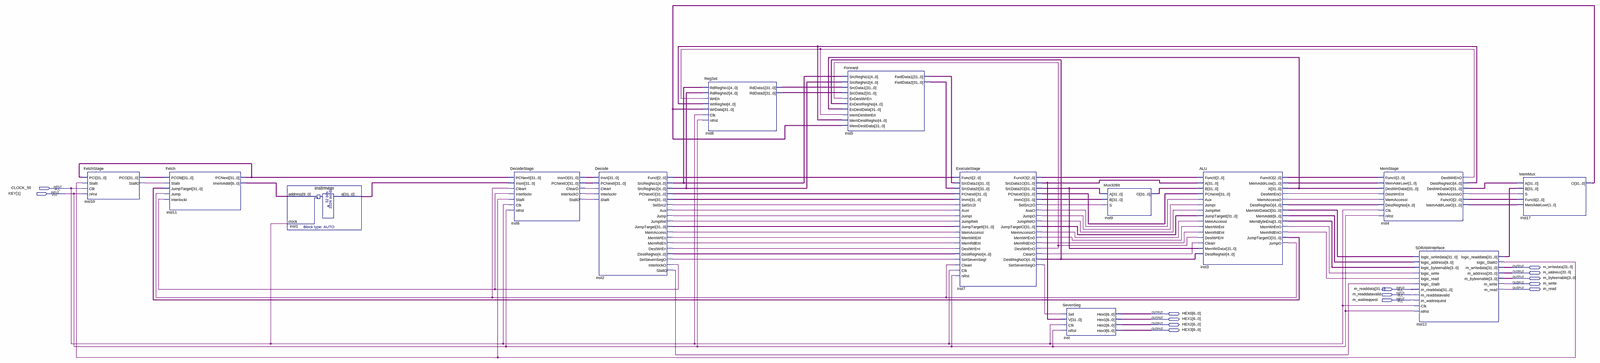
[diagram p0: schematic sheet, whole]
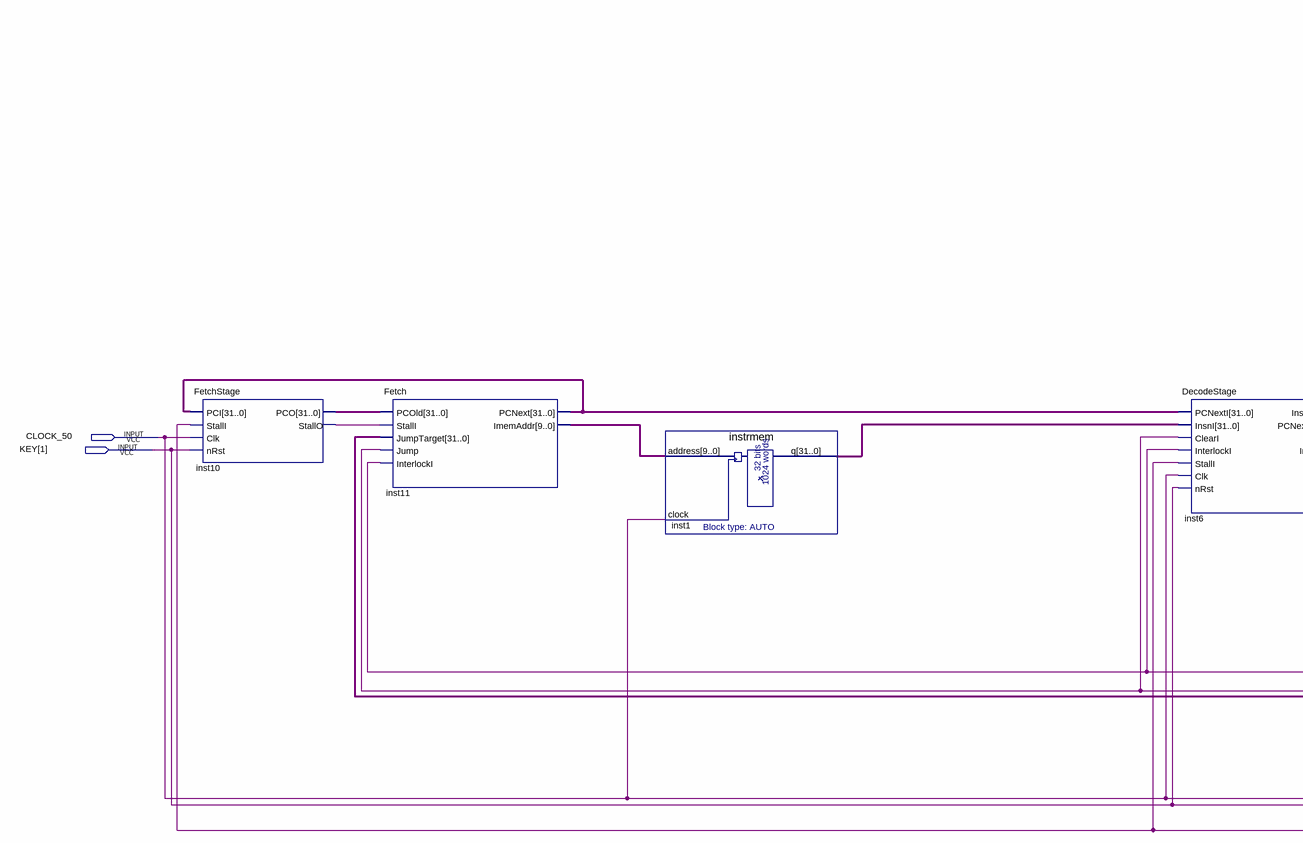
[diagram p1: schematic sheet, left part]
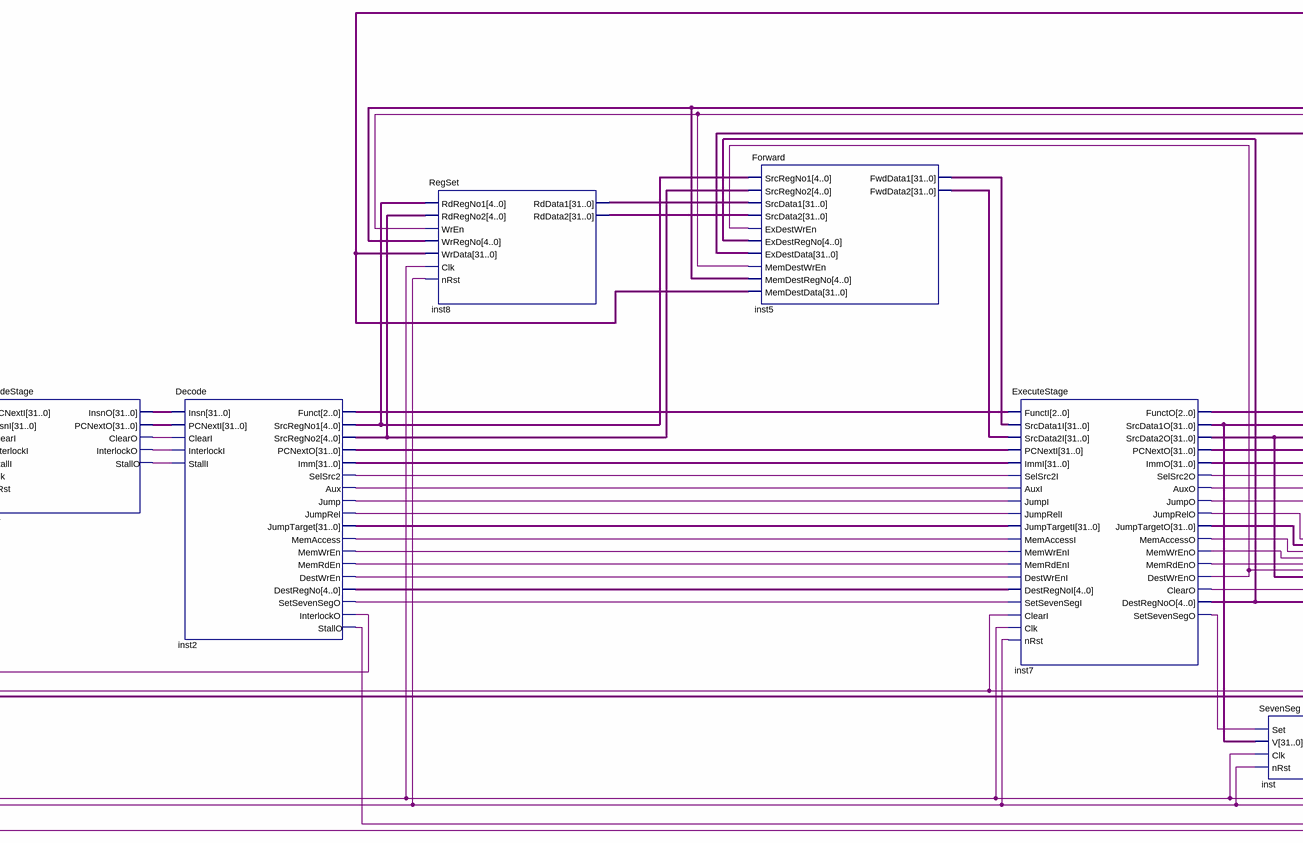
[diagram p2: schematic sheet, centre part]
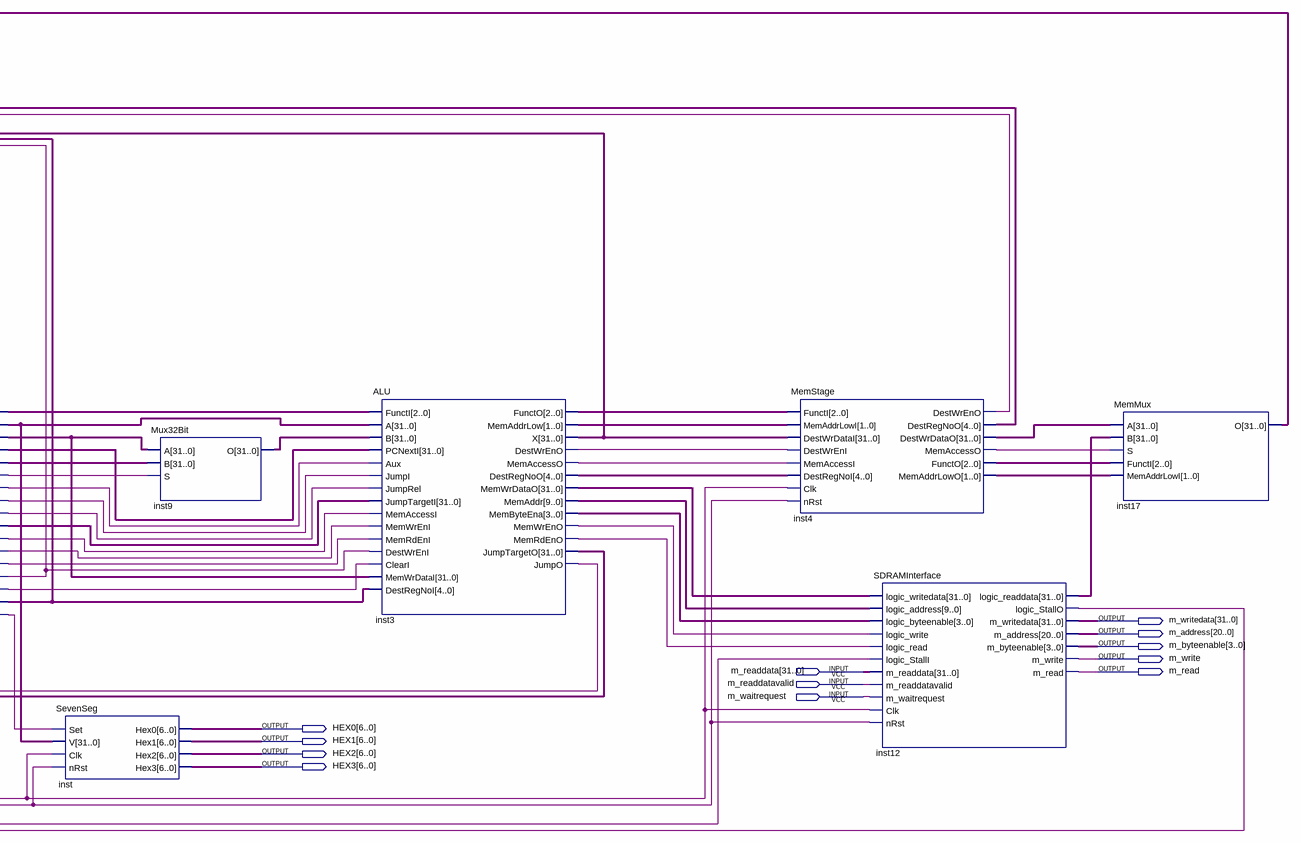
[diagram p3: schematic sheet, right part]
// Quartus schematic RISCV_SDRAM.bdf as structural Verilog: 14 symbols, 14 pins
module RISCV_SDRAM (
  input  CLOCK_50,
  input  [1:1] KEY,
  input  [31:0] m_readdata,
  input  m_readdatavalid,
  input  m_waitrequest,
  output [31:0] m_writedata,
  output [20:0] m_address,
  output [3:0] m_byteenable,
  output m_write,
  output m_read,
  output [6:0] HEX0,
  output [6:0] HEX1,
  output [6:0] HEX2,
  output [6:0] HEX3
);

  wire inst2_aux, inst2_destwren, inst2_interlocko, inst2_jump, inst2_jumprel, inst2_memaccess,
       inst2_memrden, inst2_memwren, inst2_selsrc2, inst2_setsevensego, inst2_stallo, inst3_destwreno,
       inst3_jumpo, inst3_memaccesso, inst3_memrdeno, inst3_memwreno, inst4_destwreno, inst4_memaccesso,
       inst6_clearo, inst6_interlocko, inst6_stallo, inst7_auxo, inst7_clearo, inst7_destwreno, inst7_jumpo,
       inst7_jumprelo, inst7_memaccesso, inst7_memrdeno, inst7_memwreno, inst7_selsrc2o, inst7_setsevensego,
       inst10_stallo, inst12_logic_stallo;
  wire [1:0] inst3_memaddrlow, inst4_memaddrlowo;
  wire [2:0] inst2_funct, inst3_functo, inst4_functo, inst7_functo;
  wire [3:0] inst3_membyteena;
  wire [4:0] inst2_destregno, inst2_srcregno1, inst2_srcregno2, inst3_destregnoo, inst4_destregnoo,
       inst7_destregnoo;
  wire [9:0] inst3_memaddr, inst11_imemaddr;
  wire [31:0] inst1_q, inst2_imm, inst2_jumptarget, inst2_pcnexto, inst3_jumptargeto, inst3_memwrdatao,
       inst3_x, inst4_destwrdatao, inst5_fwddata1, inst5_fwddata2, inst6_insno, inst6_pcnexto, inst7_immo,
       inst7_jumptargeto, inst7_pcnexto, inst7_srcdata1o, inst7_srcdata2o, inst8_rddata1, inst8_rddata2,
       inst9_o, inst10_pco, inst11_pcnext, inst12_logic_readdata, inst17_o;

  FetchStage inst10 (
    .PCI(inst11_pcnext), .StallI(inst12_logic_stallo), .Clk(CLOCK_50), .nRst(KEY[1]), .PCO(inst10_pco),
    .StallO(inst10_stallo));
  Fetch inst11 (
    .PCOld(inst10_pco), .StallI(inst10_stallo), .JumpTarget(inst3_jumptargeto), .Jump(inst3_jumpo),
    .InterlockI(inst2_interlocko), .PCNext(inst11_pcnext), .ImemAddr(inst11_imemaddr));
  instrmem inst1 (.address(inst11_imemaddr), .clock(CLOCK_50), .q(inst1_q));
  DecodeStage inst6 (
    .PCNextI(inst11_pcnext), .InsnI(inst1_q), .ClearI(inst3_jumpo), .InterlockI(inst2_interlocko),
    .StallI(inst12_logic_stallo), .Clk(CLOCK_50), .nRst(KEY[1]), .InsnO(inst6_insno),
    .PCNextO(inst6_pcnexto), .ClearO(inst6_clearo), .InterlockO(inst6_interlocko), .StallO(inst6_stallo));
  Decode inst2 (
    .Insn(inst6_insno), .PCNextI(inst6_pcnexto), .ClearI(inst6_clearo), .InterlockI(inst6_interlocko),
    .StallI(inst6_stallo), .Funct(inst2_funct), .SrcRegNo1(inst2_srcregno1), .SrcRegNo2(inst2_srcregno2),
    .PCNextO(inst2_pcnexto), .Imm(inst2_imm), .SelSrc2(inst2_selsrc2), .Aux(inst2_aux), .Jump(inst2_jump),
    .JumpRel(inst2_jumprel), .JumpTarget(inst2_jumptarget), .MemAccess(inst2_memaccess),
    .MemWrEn(inst2_memwren), .MemRdEn(inst2_memrden), .DestWrEn(inst2_destwren), .DestRegNo(inst2_destregno),
    .SetSevenSegO(inst2_setsevensego), .InterlockO(inst2_interlocko), .StallO(inst2_stallo));
  RegSet inst8 (
    .RdRegNo1(inst2_srcregno1), .RdRegNo2(inst2_srcregno2), .WrEn(inst4_destwreno),
    .WrRegNo(inst4_destregnoo), .WrData(inst17_o), .Clk(CLOCK_50), .nRst(KEY[1]), .RdData1(inst8_rddata1),
    .RdData2(inst8_rddata2));
  Forward inst5 (
    .SrcRegNo1(inst2_srcregno1), .SrcRegNo2(inst2_srcregno2), .SrcData1(inst8_rddata1),
    .SrcData2(inst8_rddata2), .ExDestWrEn(inst7_destwreno), .ExDestRegNo(inst7_destregnoo),
    .ExDestData(inst3_x), .MemDestWrEn(inst4_destwreno), .MemDestRegNo(inst4_destregnoo),
    .MemDestData(inst17_o), .FwdData1(inst5_fwddata1), .FwdData2(inst5_fwddata2));
  ExecuteStage inst7 (
    .FunctI(inst2_funct), .SrcData1I(inst5_fwddata1), .SrcData2I(inst5_fwddata2), .PCNextI(inst2_pcnexto),
    .ImmI(inst2_imm), .SelSrc2I(inst2_selsrc2), .AuxI(inst2_aux), .JumpI(inst2_jump),
    .JumpRelI(inst2_jumprel), .JumpTargetI(inst2_jumptarget), .MemAccessI(inst2_memaccess),
    .MemWrEnI(inst2_memwren), .MemRdEnI(inst2_memrden), .DestWrEnI(inst2_destwren),
    .DestRegNoI(inst2_destregno), .SetSevenSegI(inst2_setsevensego), .ClearI(inst3_jumpo), .Clk(CLOCK_50),
    .nRst(KEY[1]), .FunctO(inst7_functo), .SrcData1O(inst7_srcdata1o), .SrcData2O(inst7_srcdata2o),
    .PCNextO(inst7_pcnexto), .ImmO(inst7_immo), .SelSrc2O(inst7_selsrc2o), .AuxO(inst7_auxo),
    .JumpO(inst7_jumpo), .JumpRelO(inst7_jumprelo), .JumpTargetO(inst7_jumptargeto),
    .MemAccessO(inst7_memaccesso), .MemWrEnO(inst7_memwreno), .MemRdEnO(inst7_memrdeno),
    .DestWrEnO(inst7_destwreno), .ClearO(inst7_clearo), .DestRegNoO(inst7_destregnoo),
    .SetSevenSegO(inst7_setsevensego));
  SevenSeg inst (
    .Set(inst7_setsevensego), .V(inst7_srcdata1o), .Clk(CLOCK_50), .nRst(KEY[1]), .Hex0(HEX0), .Hex1(HEX1),
    .Hex2(HEX2), .Hex3(HEX3));
  Mux32Bit inst9 (.A(inst7_srcdata2o), .B(inst7_immo), .S(inst7_selsrc2o), .O(inst9_o));
  ALU inst3 (
    .FunctI(inst7_functo), .A(inst7_srcdata1o), .B(inst9_o), .PCNextI(inst7_pcnexto), .Aux(inst7_auxo),
    .JumpI(inst7_jumpo), .JumpRel(inst7_jumprelo), .JumpTargetI(inst7_jumptargeto),
    .MemAccessI(inst7_memaccesso), .MemWrEnI(inst7_memwreno), .MemRdEnI(inst7_memrdeno),
    .DestWrEnI(inst7_destwreno), .ClearI(inst7_clearo), .MemWrDataI(inst7_srcdata2o),
    .DestRegNoI(inst7_destregnoo), .FunctO(inst3_functo), .MemAddrLow(inst3_memaddrlow), .X(inst3_x),
    .DestWrEnO(inst3_destwreno), .MemAccessO(inst3_memaccesso), .DestRegNoO(inst3_destregnoo),
    .MemWrDataO(inst3_memwrdatao), .MemAddr(inst3_memaddr), .MemByteEna(inst3_membyteena),
    .MemWrEnO(inst3_memwreno), .MemRdEnO(inst3_memrdeno), .JumpTargetO(inst3_jumptargeto), .JumpO(inst3_jumpo));
  MemStage inst4 (
    .FunctI(inst3_functo), .MemAddrLowI(inst3_memaddrlow), .DestWrDataI(inst3_x),
    .DestWrEnI(inst3_destwreno), .MemAccessI(inst3_memaccesso), .DestRegNoI(inst3_destregnoo),
    .Clk(CLOCK_50), .nRst(KEY[1]), .DestWrEnO(inst4_destwreno), .DestRegNoO(inst4_destregnoo),
    .DestWrDataO(inst4_destwrdatao), .MemAccessO(inst4_memaccesso), .FunctO(inst4_functo),
    .MemAddrLowO(inst4_memaddrlowo));
  SDRAMInterface inst12 (
    .logic_writedata(inst3_memwrdatao), .logic_address(inst3_memaddr), .logic_byteenable(inst3_membyteena),
    .logic_write(inst3_memwreno), .logic_read(inst3_memrdeno), .logic_StallI(inst2_stallo),
    .m_readdata(m_readdata), .m_readdatavalid(m_readdatavalid), .m_waitrequest(m_waitrequest),
    .Clk(CLOCK_50), .nRst(KEY[1]), .logic_readdata(inst12_logic_readdata),
    .logic_StallO(inst12_logic_stallo), .m_writedata(m_writedata), .m_address(m_address),
    .m_byteenable(m_byteenable), .m_write(m_write), .m_read(m_read));
  MemMux inst17 (
    .A(inst4_destwrdatao), .B(inst12_logic_readdata), .S(inst4_memaccesso), .FunctI(inst4_functo),
    .MemAddrLowI(inst4_memaddrlowo), .O(inst17_o));
endmodule
